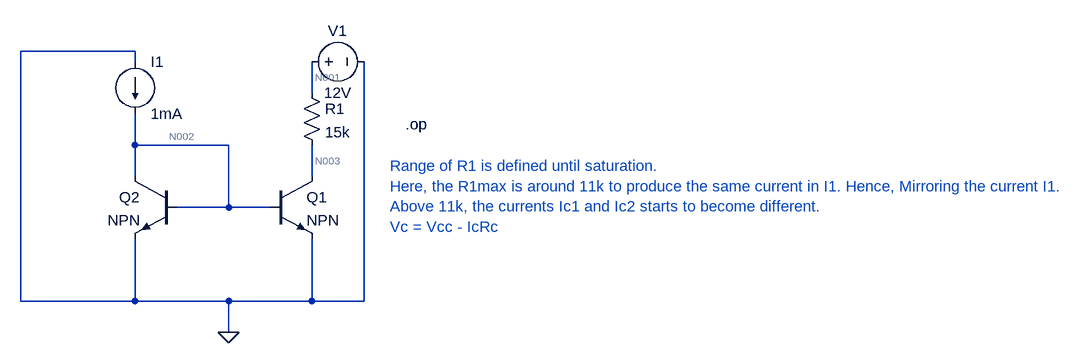
[diagram p0: schematic current_mirros.asc]
current_mirros.asc, the LTspice schematic file:
Version 4.1
SHEET 1 1624 680
WIRE 96 -64 -80 -64
WIRE 96 -48 96 -64
WIRE 368 0 368 -48
WIRE 96 80 96 32
WIRE 240 80 96 80
WIRE 96 128 96 80
WIRE 368 128 368 80
WIRE 240 176 240 80
WIRE 240 176 160 176
WIRE 304 176 240 176
WIRE -80 320 -80 -64
WIRE 96 320 96 224
WIRE 96 320 -80 320
WIRE 240 320 96 320
WIRE 368 320 368 224
WIRE 368 320 240 320
WIRE 448 320 448 -48
WIRE 448 320 368 320
WIRE 240 368 240 320
FLAG 240 368 0
DATAFLAG 176 176 ""
DATAFLAG 144 320 ""
DATAFLAG 96 48 ""
DATAFLAG 368 -32 ""
DATAFLAG 368 96 ""
DATAFLAG 368 256 ""
DATAFLAG 288 176 ""
DATAFLAG 176 320 ""
SYMBOL npn 304 128 R0
SYMATTR InstName Q1
SYMBOL npn 160 128 M0
SYMATTR InstName Q2
SYMBOL current 96 -48 R0
WINDOW 123 0 0 Left 0
WINDOW 39 0 0 Left 0
SYMATTR InstName I1
SYMATTR Value 1mA
SYMBOL voltage 352 -48 R270
WINDOW 0 32 56 VTop 2
WINDOW 3 -32 56 VBottom 2
WINDOW 123 0 0 Left 0
WINDOW 39 0 0 Left 0
SYMATTR InstName V1
SYMATTR Value 12V
SYMBOL res 352 -16 R0
SYMATTR InstName R1
SYMATTR Value 15k
TEXT 512 48 Left 2 !.op
TEXT 488 112 Left 2 ;Range of R1 is defined until saturation.\nHere, the R1max is around 11k to produce the same current in I1. Hence, Mirroring the current I1.\nAbove 11k, the currents Ic1 and Ic2 starts to become different.\nVc = Vcc - IcRc

The netlist it stands for:
* current_mirros.asc
Q1 N003 N002 0 0 NPN
Q2 N002 N002 0 0 NPN
I1 0 N002 1mA
V1 N001 0 12V
R1 N001 N003 15k
.model NPN NPN
.model PNP PNP
.lib standard.bjt
.op
* Range of R1 is defined until saturation.
* Here, the R1max is around 11k to produce the same current in I1. Hence, Mirroring the current I1.
* Above 11k, the currents Ic1 and Ic2 starts to become different.
* Vc = Vcc - IcRc
.backanno
.end

* Results of the author's LTspice run, read from the files saved beside the schematic
* Operating Point:
*   V(n002) = 772.1 mV
*   V(n003) = 69.71 mV
*   V(n001) = 12 V
*   Ic(Q1) = 795.4 µA
*   Ib(Q1) = 71.28 µA
*   Ie(Q1) = -866.6 µA
*   Is(Q1) = 0 A
*   I(I1) = 1 mA
*   I(R1) = 795.4 µA
*   Ic(Q2) = 919.5 µA
*   Ib(Q2) = 9.195 µA
*   Ie(Q2) = -928.7 µA
*   Is(Q2) = 0 A
*   I(V1) = -795.4 µA